# EAGLE design expCard (EAGLE 4.16)
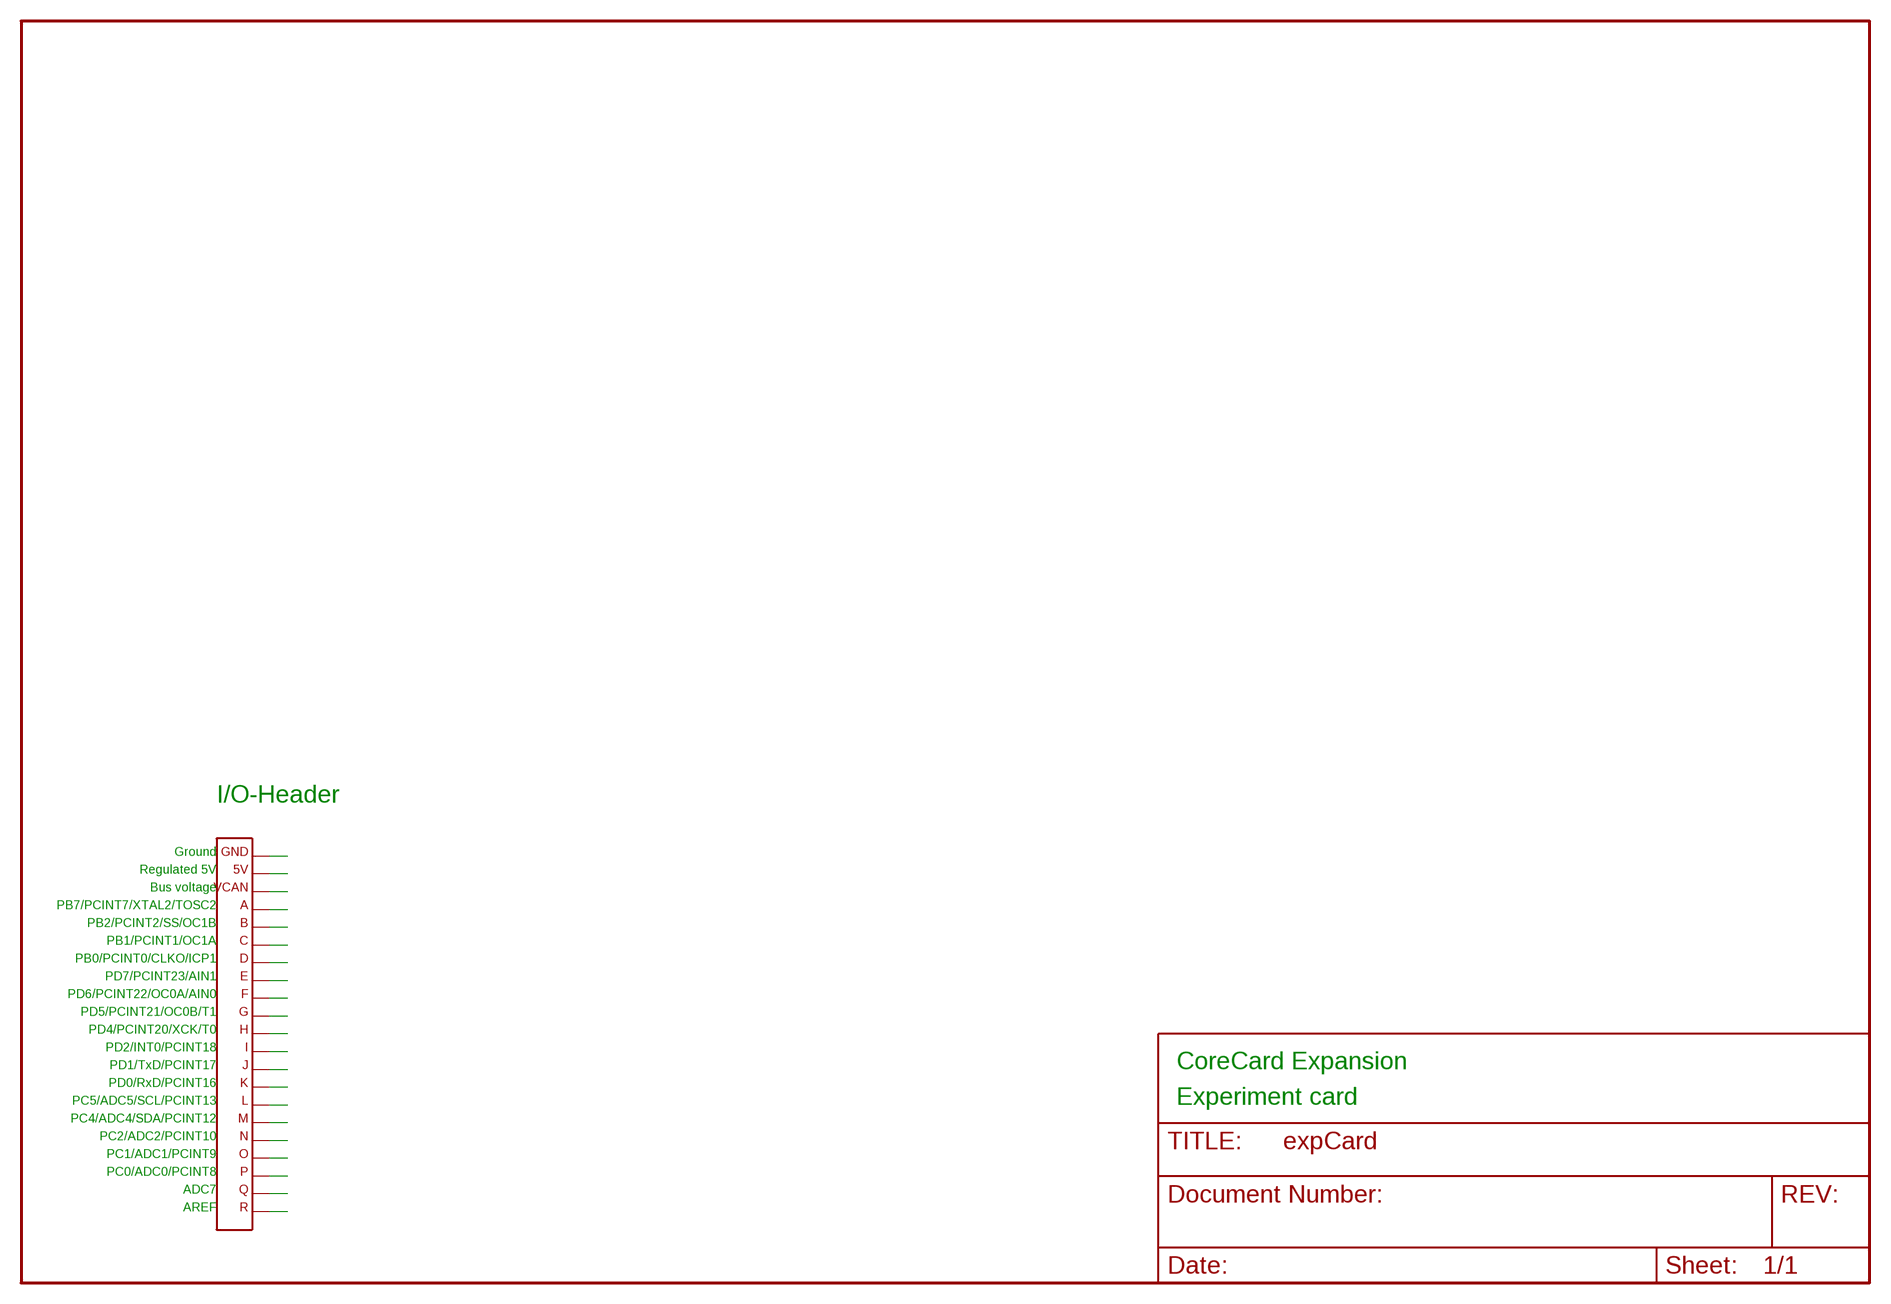
[diagram p0: schematic, sheet 1]

## Parts
X3  CORE_IOHEADEXP  [CORE_IOHEAD_NOSILC]

## Nets
EXP_A: X3.4
EXP_B: X3.5
EXP_C: X3.6
EXP_D: X3.7
EXP_E: X3.8
EXP_F: X3.9
EXP_G: X3.10
EXP_H: X3.11
EXP_I: X3.12
EXP_J: X3.13
EXP_K: X3.14
EXP_L: X3.15
EXP_M: X3.16
EXP_N: X3.17
EXP_O: X3.18
EXP_P: X3.19
EXP_Q: X3.20
EXP_R: X3.21
GND: X3.1
V_CAN: X3.3
VCC: X3.2

## Notes on the sheet
- I/O-Header
- Ground
- Regulated 5V
- Bus voltage
- PB7/PCINT7/XTAL2/TOSC2
- PB2/PCINT2/SS/OC1B
- PB1/PCINT1/OC1A
- PB0/PCINT0/CLKO/ICP1
- PD7/PCINT23/AIN1
- PD6/PCINT22/OC0A/AIN0
- PD5/PCINT21/OC0B/T1
- PD4/PCINT20/XCK/T0
- PD2/INT0/PCINT18
- PD1/TxD/PCINT17 | CoreCard Expansion
- PD0/RxD/PCINT16
- PC5/ADC5/SCL/PCINT13 | Experiment card
- PC4/ADC4/SDA/PCINT12
- PC2/ADC2/PCINT10
- PC1/ADC1/PCINT9
- PC0/ADC0/PCINT8
- ADC7
- AREF

## Library data of the parts
X3 = expboard:CORE_IOHEAD: CoreCard IO-header for expansion cards

## Board
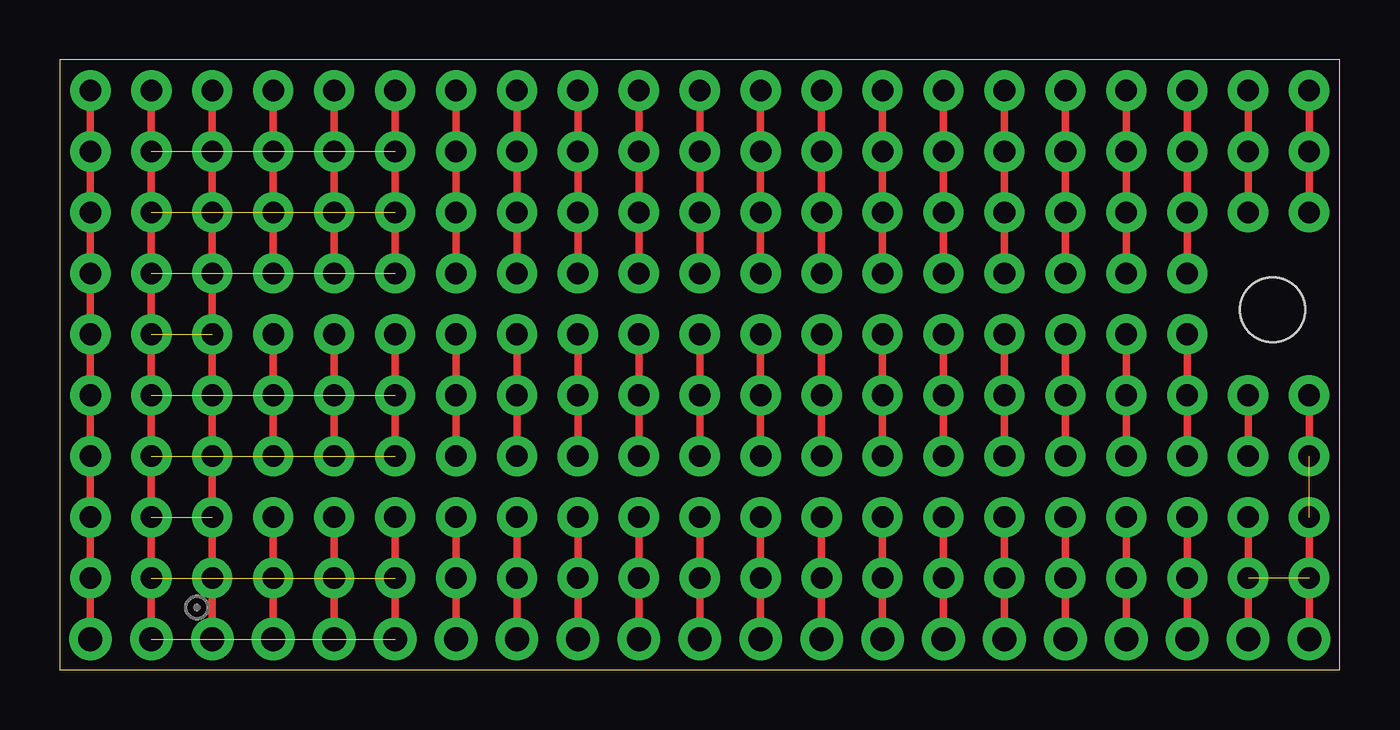
[diagram p1: board, top side]
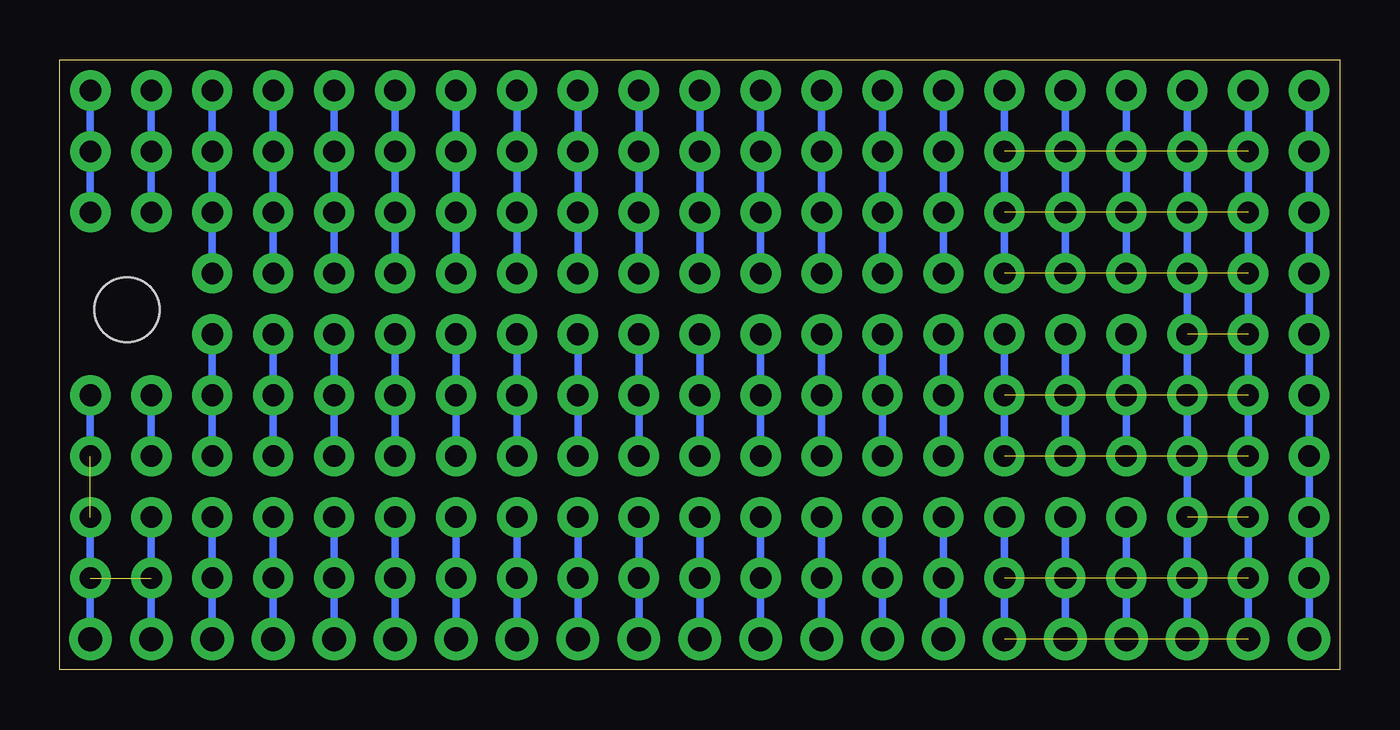
[diagram p2: board, bottom side, seen from below]

Size 53.34 x 25.4 mm. Coordinates in mm from the lower left corner, seen from the top.
Outline: 0,0 53.34,0 53.34,25.4 0,25.4 0,0
Copper layers (1*16): Top 0.035mm / dielectric 1.5mm / Bottom 0.035mm
Design rules "default": minimum track width 10mil, minimum drill 0.4mm, track to track 10mil, track to pad 10mil, pad to pad 10mil, via to via 10mil, smd to smd 8mil, copper to edge 10mil, drill to drill 8mil, minimum pad ring 10mil, minimum via ring 10mil, stop-mask expansion 4mil, vias tented up to drill 18mil, thermal gap 10mil
Holes 2.7 mm at 50.55,14.99

### Footprints (pad centres in the part's own frame; a part is rotated, then mirrored left to right if it is on the bottom)
CORE_IOHEAD_NOSILC = drill 1 pad 1.778 round: 1 25.4,0; 2 22.86,0; 3 20.32,0; 4 17.78,0; 5 15.24,0; 6 12.7,0; 7 10.16,0; 8 7.62,0; 9 5.08,0; 10 2.54,0; 11 0,0; 12 -2.54,0; 13 -5.08,0; 14 -7.62,0; 15 -10.16,0; 16 -12.7,0; 17 -15.24,0; 18 -17.78,0; 19 -20.32,0; 20 -22.86,0; 21 -25.4,0

### Placement (x,y rotation side)
X3  26.67,1.27 0 bottom

### Tracks (layer width: path | path; a pad name or v marks a point on that pad's centre or on a via)
GND  (via drill 0.9 pad 1.68)
  Top 0.305: X3.1 v1.27,3.81 X3.1
  Bottom 0.305: X3.1 v1.27,3.81
GND1  (via drill 0.9 pad 1.68)
  Top 0.305: v1.27,6.35 1.27,3.81 v1.27,6.35
  Bottom 0.305: 1.27,3.81 v1.27,6.35
GND2  (via drill 0.9 pad 1.68)
  Top 0.305: v1.27,8.89 1.27,6.35 v1.27,8.89
  Bottom 0.305: 1.27,6.35 v1.27,8.89
GND3  (via drill 0.9 pad 1.68)
  Top 0.305: v1.27,11.43 1.27,8.89 v1.27,11.43
  Bottom 0.305: 1.27,8.89 v1.27,11.43
GND4  (via drill 0.9 pad 1.68)
  Top 0.305: v1.27,13.97 1.27,11.43 v1.27,13.97
  Bottom 0.305: 1.27,11.43 v1.27,13.97
GND5  (via drill 0.9 pad 1.68)
  Top 0.305: v1.27,16.51 1.27,13.97 v1.27,16.51
  Bottom 0.305: 1.27,13.97 v1.27,16.51
GND6  (via drill 0.9 pad 1.68)
  Top 0.305: v1.27,19.05 1.27,16.51 v1.27,19.05
  Bottom 0.305: 1.27,16.51 v1.27,19.05
GND7  (via drill 0.9 pad 1.68)
  Top 0.305: v1.27,21.59 1.27,19.05 v1.27,21.59
  Bottom 0.305: 1.27,19.05 v1.27,21.59
GND8  (via drill 0.9 pad 1.68)
  Top 0.305: v1.27,24.13 1.27,21.59 v1.27,24.13
  Bottom 0.305: 1.27,21.59 v1.27,24.13
N$1  (via drill 0.9 pad 1.68)
  other vias: 3.81,3.81
N$2  (via drill 0.9 pad 1.68)
  other vias: 6.35,3.81
N$3  (via drill 0.9 pad 1.68)
  other vias: 8.89,3.81
N$4  (via drill 0.9 pad 1.68)
  other vias: 11.43,3.81
N$5  (via drill 0.9 pad 1.68)
  other vias: 13.97,3.81
N$6  (via drill 0.9 pad 1.68)
  other vias: 16.51,3.81
N$7  (via drill 0.9 pad 1.68)
  other vias: 19.05,3.81
N$8  (via drill 0.9 pad 1.68)
  other vias: 21.59,3.81
N$9  (via drill 0.9 pad 1.68)
  other vias: 24.13,3.81
N$10  (via drill 0.9 pad 1.68)
  other vias: 26.67,3.81
N$11  (via drill 0.9 pad 1.68)
  other vias: 29.21,3.81
N$12  (via drill 0.9 pad 1.68)
  other vias: 31.75,3.81
N$13  (via drill 0.9 pad 1.68)
  other vias: 34.29,3.81
N$14  (via drill 0.9 pad 1.68)
  other vias: 36.83,3.81
N$15  (via drill 0.9 pad 1.68)
  other vias: 39.37,3.81
N$16  (via drill 0.9 pad 1.68)
  other vias: 41.91,3.81
N$17  (via drill 0.9 pad 1.68)
  other vias: 44.45,3.81
N$18  (via drill 0.9 pad 1.68)
  other vias: 46.99,3.81
N$19  (via drill 0.9 pad 1.68)
  other vias: 49.53,3.81
N$20  (via drill 0.9 pad 1.68)  (1 unrouted)
  Top 0.305: v52.07,3.81 v52.07,6.35 | v52.07,8.89 v52.07,11.43
  Bottom 0.305: v52.07,6.35 v52.07,3.81 52.07,1.27 | v52.07,8.89 v52.07,11.43
N$21  (4 unrouted)
  Bottom 0.305: 3.81,1.27 3.81,3.81 | 6.35,1.27 6.35,3.81 | 8.89,1.27 8.89,3.81 | 11.43,1.27 11.43,3.81 | 13.97,1.27 13.97,3.81
N$22  (4 unrouted)
  Top 0.305: 3.81,1.27 3.81,3.81 | 6.35,1.27 6.35,3.81 | 8.89,1.27 8.89,3.81 | 11.43,1.27 11.43,3.81 | 13.97,1.27 13.97,3.81
N$23
  Bottom 0.305: 16.51,1.27 16.51,3.81
N$24
  Top 0.305: 16.51,1.27 16.51,3.81
N$25
  Bottom 0.305: 19.05,1.27 19.05,3.81
N$26
  Top 0.305: 19.05,1.27 19.05,3.81
N$27
  Bottom 0.305: 21.59,1.27 21.59,3.81
N$28
  Top 0.305: 21.59,1.27 21.59,3.81
N$29
  Bottom 0.305: 24.13,1.27 24.13,3.81
N$30
  Top 0.305: 24.13,1.27 24.13,3.81
N$31
  Bottom 0.305: 26.67,1.27 26.67,3.81
N$32
  Top 0.305: 26.67,1.27 26.67,3.81
N$33
  Bottom 0.305: 29.21,1.27 29.21,3.81
N$34
  Top 0.305: 29.21,1.27 29.21,3.81
N$35
  Bottom 0.305: 31.75,1.27 31.75,3.81
N$36
  Top 0.305: 31.75,1.27 31.75,3.81
N$37
  Bottom 0.305: 34.29,1.27 34.29,3.81
N$38
  Top 0.305: 34.29,1.27 34.29,3.81
N$39
  Bottom 0.305: 36.83,1.27 36.83,3.81
N$40
  Top 0.305: 36.83,1.27 36.83,3.81
N$41
  Bottom 0.305: 39.37,1.27 39.37,3.81
N$42
  Top 0.305: 39.37,1.27 39.37,3.81
N$43
  Bottom 0.305: 41.91,1.27 41.91,3.81
N$44
  Top 0.305: 41.91,1.27 41.91,3.81
N$45
  Bottom 0.305: 44.45,1.27 44.45,3.81
N$46
  Top 0.305: 44.45,1.27 44.45,3.81
N$47
  Bottom 0.305: 46.99,1.27 46.99,3.81
N$48
  Top 0.305: 46.99,1.27 46.99,3.81
N$49
  Bottom 0.305: 49.53,1.27 49.53,3.81
N$50
  Top 0.305: 49.53,1.27 49.53,3.81
N$51  (via drill 0.9 pad 1.68)
  other vias: 3.81,6.35
N$52  (via drill 0.9 pad 1.68)
  other vias: 6.35,6.35
N$53  (via drill 0.9 pad 1.68)
  other vias: 8.89,6.35
N$54  (via drill 0.9 pad 1.68)
  other vias: 11.43,6.35
N$55  (via drill 0.9 pad 1.68)
  other vias: 13.97,6.35
N$56  (via drill 0.9 pad 1.68)
  other vias: 16.51,6.35
N$57  (via drill 0.9 pad 1.68)
  other vias: 19.05,6.35
N$58  (via drill 0.9 pad 1.68)
  other vias: 21.59,6.35
N$59  (via drill 0.9 pad 1.68)
  other vias: 24.13,6.35
N$60  (via drill 0.9 pad 1.68)
  other vias: 26.67,6.35
N$61  (via drill 0.9 pad 1.68)
  other vias: 29.21,6.35
N$62  (via drill 0.9 pad 1.68)
  other vias: 31.75,6.35
N$63  (via drill 0.9 pad 1.68)
  other vias: 34.29,6.35
N$64  (via drill 0.9 pad 1.68)
  other vias: 36.83,6.35
N$65  (via drill 0.9 pad 1.68)
  other vias: 39.37,6.35
N$66  (via drill 0.9 pad 1.68)
  other vias: 41.91,6.35
N$67  (via drill 0.9 pad 1.68)
  other vias: 44.45,6.35
N$68  (via drill 0.9 pad 1.68)
  other vias: 46.99,6.35
N$69  (via drill 0.9 pad 1.68)
  other vias: 49.53,6.35
N$70  (via drill 0.9 pad 1.68)
  Top 0.305: v52.07,19.05 v52.07,21.59
  Bottom 0.305: v52.07,19.05 v52.07,21.59
N$71  (4 unrouted)
  Bottom 0.305: 3.81,3.81 3.81,6.35 | 6.35,3.81 6.35,6.35 | 8.89,3.81 8.89,6.35 | 11.43,3.81 11.43,6.35 | 13.97,3.81 13.97,6.35
N$72  (4 unrouted)
  Top 0.305: 3.81,3.81 3.81,6.35 | 6.35,3.81 6.35,6.35 | 8.89,3.81 8.89,6.35 | 11.43,3.81 11.43,6.35 | 13.97,3.81 13.97,6.35
N$73
  Bottom 0.305: 16.51,3.81 16.51,6.35
N$74
  Top 0.305: 16.51,3.81 16.51,6.35
N$75
  Bottom 0.305: 19.05,3.81 19.05,6.35
N$76
  Top 0.305: 19.05,3.81 19.05,6.35
N$77
  Bottom 0.305: 21.59,3.81 21.59,6.35
N$78
  Top 0.305: 21.59,3.81 21.59,6.35
N$79
  Bottom 0.305: 24.13,3.81 24.13,6.35
N$80
  Top 0.305: 24.13,3.81 24.13,6.35
N$81
  Bottom 0.305: 26.67,3.81 26.67,6.35
N$82
  Top 0.305: 26.67,3.81 26.67,6.35
N$83
  Bottom 0.305: 29.21,3.81 29.21,6.35
N$84
  Top 0.305: 29.21,3.81 29.21,6.35
N$85
  Bottom 0.305: 31.75,3.81 31.75,6.35
N$86
  Top 0.305: 31.75,3.81 31.75,6.35
N$87
  Bottom 0.305: 34.29,3.81 34.29,6.35
N$88
  Top 0.305: 34.29,3.81 34.29,6.35
N$89
  Bottom 0.305: 36.83,3.81 36.83,6.35
N$90
  Top 0.305: 36.83,3.81 36.83,6.35
N$91
  Bottom 0.305: 39.37,3.81 39.37,6.35
N$92
  Top 0.305: 39.37,3.81 39.37,6.35
N$93
  Bottom 0.305: 41.91,3.81 41.91,6.35
N$94
  Top 0.305: 41.91,3.81 41.91,6.35
N$95
  Bottom 0.305: 44.45,3.81 44.45,6.35
N$96
  Top 0.305: 44.45,3.81 44.45,6.35
N$97
  Bottom 0.305: 46.99,3.81 46.99,6.35
N$98
  Top 0.305: 46.99,3.81 46.99,6.35
N$99
  Bottom 0.305: 49.53,3.81 49.53,6.35
N$100  (1 unrouted)
  Top 0.305: 49.53,3.81 49.53,6.35 | 52.07,1.27 52.07,3.81
N$101  (via drill 0.9 pad 1.68)
  other vias: 3.81,8.89
N$102  (via drill 0.9 pad 1.68)
  other vias: 6.35,8.89
N$103  (via drill 0.9 pad 1.68)
  other vias: 8.89,8.89
N$104  (via drill 0.9 pad 1.68)
  other vias: 11.43,8.89
N$105  (via drill 0.9 pad 1.68)
  other vias: 13.97,8.89
N$106  (via drill 0.9 pad 1.68)
  other vias: 16.51,8.89
N$107  (via drill 0.9 pad 1.68)
  other vias: 19.05,8.89
N$108  (via drill 0.9 pad 1.68)
  other vias: 21.59,8.89
N$109  (via drill 0.9 pad 1.68)
  other vias: 24.13,8.89
N$110  (via drill 0.9 pad 1.68)
  other vias: 26.67,8.89
N$111  (via drill 0.9 pad 1.68)
  other vias: 29.21,8.89
N$112  (via drill 0.9 pad 1.68)
  other vias: 31.75,8.89
N$113  (via drill 0.9 pad 1.68)
  other vias: 34.29,8.89
N$114  (via drill 0.9 pad 1.68)
  other vias: 36.83,8.89
N$115  (via drill 0.9 pad 1.68)
  other vias: 39.37,8.89
N$116  (via drill 0.9 pad 1.68)
  other vias: 41.91,8.89
N$117  (via drill 0.9 pad 1.68)
  other vias: 44.45,8.89
N$118  (via drill 0.9 pad 1.68)
  other vias: 46.99,8.89
N$119  (via drill 0.9 pad 1.68)
  other vias: 49.53,8.89
N$120  (via drill 0.9 pad 1.68)
  other vias: 49.53,19.05
N$121  (1 unrouted)
  Bottom 0.305: 3.81,6.35 3.81,8.89 | 6.35,6.35 6.35,8.89
N$122  (1 unrouted)
  Top 0.305: 3.81,6.35 3.81,8.89 | 6.35,6.35 6.35,8.89
N$151  (via drill 0.9 pad 1.68)
  other vias: 3.81,11.43
N$152  (via drill 0.9 pad 1.68)
  other vias: 6.35,11.43
N$153  (via drill 0.9 pad 1.68)
  other vias: 8.89,11.43
N$154  (via drill 0.9 pad 1.68)
  other vias: 11.43,11.43
N$155  (via drill 0.9 pad 1.68)
  other vias: 13.97,11.43
N$156  (via drill 0.9 pad 1.68)
  other vias: 16.51,11.43
N$157  (via drill 0.9 pad 1.68)
  other vias: 19.05,11.43
N$158  (via drill 0.9 pad 1.68)
  other vias: 21.59,11.43
N$159  (via drill 0.9 pad 1.68)
  other vias: 24.13,11.43
N$160  (via drill 0.9 pad 1.68)
  other vias: 26.67,11.43
N$161  (via drill 0.9 pad 1.68)
  other vias: 29.21,11.43
N$162  (via drill 0.9 pad 1.68)
  other vias: 31.75,11.43
N$163  (via drill 0.9 pad 1.68)
  other vias: 34.29,11.43
N$164  (via drill 0.9 pad 1.68)
  other vias: 36.83,11.43
N$165  (via drill 0.9 pad 1.68)
  other vias: 39.37,11.43
N$166  (via drill 0.9 pad 1.68)
  other vias: 41.91,11.43
N$167  (via drill 0.9 pad 1.68)
  other vias: 44.45,11.43
N$168  (via drill 0.9 pad 1.68)
  other vias: 46.99,11.43
N$169  (via drill 0.9 pad 1.68)
  other vias: 49.53,11.43
N$170  (4 unrouted)
  Bottom 0.305: 3.81,8.89 3.81,11.43 | 6.35,8.89 6.35,11.43 | 8.89,8.89 8.89,11.43 | 11.43,8.89 11.43,11.43 | 13.97,8.89 13.97,11.43
N$171  (4 unrouted)
  Top 0.305: 3.81,8.89 3.81,11.43 | 6.35,8.89 6.35,11.43 | 8.89,8.89 8.89,11.43 | 11.43,8.89 11.43,11.43 | 13.97,8.89 13.97,11.43
N$172
  Bottom 0.305: 16.51,8.89 16.51,11.43
N$173
  Top 0.305: 16.51,8.89 16.51,11.43
N$174
  Bottom 0.305: 19.05,8.89 19.05,11.43
N$175
  Top 0.305: 19.05,8.89 19.05,11.43
N$176
  Bottom 0.305: 21.59,8.89 21.59,11.43
N$177
  Top 0.305: 21.59,8.89 21.59,11.43
N$178
  Bottom 0.305: 24.13,8.89 24.13,11.43
N$179
  Top 0.305: 24.13,8.89 24.13,11.43
N$180
  Bottom 0.305: 26.67,8.89 26.67,11.43
N$181
  Top 0.305: 26.67,8.89 26.67,11.43
N$182
  Bottom 0.305: 29.21,8.89 29.21,11.43
N$183
  Top 0.305: 29.21,8.89 29.21,11.43
N$184
  Bottom 0.305: 31.75,8.89 31.75,11.43
N$185
  Top 0.305: 31.75,8.89 31.75,11.43
N$186
  Bottom 0.305: 34.29,8.89 34.29,11.43
N$187
  Top 0.305: 34.29,8.89 34.29,11.43
N$188
  Bottom 0.305: 36.83,8.89 36.83,11.43
N$189
  Top 0.305: 36.83,8.89 36.83,11.43
N$190
  Bottom 0.305: 39.37,8.89 39.37,11.43
N$191
  Top 0.305: 39.37,8.89 39.37,11.43
N$192
  Bottom 0.305: 41.91,8.89 41.91,11.43
N$193
  Top 0.305: 41.91,8.89 41.91,11.43
N$194
  Bottom 0.305: 44.45,8.89 44.45,11.43
N$195
  Top 0.305: 44.45,8.89 44.45,11.43
N$196
  Bottom 0.305: 46.99,8.89 46.99,11.43
N$197
  Top 0.305: 46.99,8.89 46.99,11.43
N$198
  Bottom 0.305: 49.53,8.89 49.53,11.43
N$199
  Top 0.305: 49.53,8.89 49.53,11.43
N$200  (via drill 0.9 pad 1.68)
  other vias: 3.81,13.97
N$201  (via drill 0.9 pad 1.68)
  other vias: 6.35,13.97
N$202  (via drill 0.9 pad 1.68)
  other vias: 8.89,13.97
N$203  (via drill 0.9 pad 1.68)
  other vias: 11.43,13.97
N$204  (via drill 0.9 pad 1.68)
  other vias: 13.97,13.97
N$205  (via drill 0.9 pad 1.68)
  other vias: 16.51,13.97
N$206  (via drill 0.9 pad 1.68)
  other vias: 19.05,13.97
N$207  (via drill 0.9 pad 1.68)
  other vias: 21.59,13.97
N$208  (via drill 0.9 pad 1.68)
  other vias: 24.13,13.97
N$209  (via drill 0.9 pad 1.68)
  other vias: 26.67,13.97
N$210  (via drill 0.9 pad 1.68)
  other vias: 29.21,13.97
N$211  (via drill 0.9 pad 1.68)
  other vias: 31.75,13.97
N$212  (via drill 0.9 pad 1.68)
  other vias: 34.29,13.97
N$213  (via drill 0.9 pad 1.68)
  other vias: 36.83,13.97
N$214  (via drill 0.9 pad 1.68)
  other vias: 39.37,13.97
N$215  (via drill 0.9 pad 1.68)
  other vias: 41.91,13.97
N$216  (via drill 0.9 pad 1.68)
  other vias: 44.45,13.97
N$217  (via drill 0.9 pad 1.68)
  other vias: 46.99,13.97
N$218  (4 unrouted)
  Bottom 0.305: 3.81,11.43 3.81,13.97 | 6.35,11.43 6.35,13.97 | 8.89,11.43 8.89,13.97 | 11.43,11.43 11.43,13.97 | 13.97,11.43 13.97,13.97
N$219  (4 unrouted)
  Top 0.305: 3.81,11.43 3.81,13.97 | 6.35,11.43 6.35,13.97 | 8.89,11.43 8.89,13.97 | 11.43,11.43 11.43,13.97 | 13.97,11.43 13.97,13.97
N$220
  Bottom 0.305: 16.51,11.43 16.51,13.97
N$221
  Top 0.305: 16.51,11.43 16.51,13.97
N$222
  Bottom 0.305: 19.05,11.43 19.05,13.97
N$223
  Top 0.305: 19.05,11.43 19.05,13.97
N$224
  Bottom 0.305: 21.59,11.43 21.59,13.97
N$225
  Top 0.305: 21.59,11.43 21.59,13.97
N$226
  Bottom 0.305: 24.13,11.43 24.13,13.97
N$227
  Top 0.305: 24.13,11.43 24.13,13.97
N$228
  Bottom 0.305: 26.67,11.43 26.67,13.97
N$229
  Top 0.305: 26.67,11.43 26.67,13.97
N$230
  Bottom 0.305: 29.21,11.43 29.21,13.97
N$231
  Top 0.305: 29.21,11.43 29.21,13.97
N$232
  Bottom 0.305: 31.75,11.43 31.75,13.97
N$233
  Top 0.305: 31.75,11.43 31.75,13.97
N$234
  Bottom 0.305: 34.29,11.43 34.29,13.97
N$235
  Top 0.305: 34.29,11.43 34.29,13.97
N$236
  Bottom 0.305: 36.83,11.43 36.83,13.97
N$237
  Top 0.305: 36.83,11.43 36.83,13.97
N$238
  Bottom 0.305: 39.37,11.43 39.37,13.97
N$239
  Top 0.305: 39.37,11.43 39.37,13.97
N$240
  Bottom 0.305: 41.91,11.43 41.91,13.97
N$241
  Top 0.305: 41.91,11.43 41.91,13.97
N$242
  Bottom 0.305: 44.45,11.43 44.45,13.97
N$243
  Top 0.305: 44.45,11.43 44.45,13.97
N$244
  Bottom 0.305: 46.99,11.43 46.99,13.97
N$245
  Top 0.305: 46.99,11.43 46.99,13.97
N$246  (via drill 0.9 pad 1.68)
  other vias: 3.81,16.51
N$247  (via drill 0.9 pad 1.68)
  other vias: 6.35,16.51
N$248  (via drill 0.9 pad 1.68)
  other vias: 8.89,16.51
N$249  (via drill 0.9 pad 1.68)
  other vias: 11.43,16.51
N$250  (via drill 0.9 pad 1.68)
  other vias: 13.97,16.51
N$251  (via drill 0.9 pad 1.68)
  other vias: 16.51,16.51
N$252  (via drill 0.9 pad 1.68)
  other vias: 19.05,16.51
N$253  (via drill 0.9 pad 1.68)
  other vias: 21.59,16.51
N$254  (via drill 0.9 pad 1.68)
  other vias: 24.13,16.51
N$255  (via drill 0.9 pad 1.68)
  other vias: 26.67,16.51
N$256  (via drill 0.9 pad 1.68)
  other vias: 29.21,16.51
N$257  (via drill 0.9 pad 1.68)
  other vias: 31.75,16.51
N$258  (via drill 0.9 pad 1.68)
  other vias: 34.29,16.51
N$259  (via drill 0.9 pad 1.68)
  other vias: 36.83,16.51
N$260  (via drill 0.9 pad 1.68)
  other vias: 39.37,16.51
N$261  (via drill 0.9 pad 1.68)
  other vias: 41.91,16.51
N$262  (via drill 0.9 pad 1.68)
  other vias: 44.45,16.51
N$263  (via drill 0.9 pad 1.68)
  other vias: 46.99,16.51
N$264  (1 unrouted)
  Bottom 0.305: 3.81,13.97 3.81,16.51 | 6.35,13.97 6.35,16.51
N$265  (1 unrouted)
  Top 0.305: 3.81,13.97 3.81,16.51 | 6.35,13.97 6.35,16.51
N$292  (via drill 0.9 pad 1.68)
  other vias: 3.81,19.05
N$293  (via drill 0.9 pad 1.68)
  other vias: 6.35,19.05
N$294  (via drill 0.9 pad 1.68)
  other vias: 8.89,19.05
N$295  (via drill 0.9 pad 1.68)
  other vias: 11.43,19.05
N$296  (via drill 0.9 pad 1.68)
  other vias: 13.97,19.05
N$297  (via drill 0.9 pad 1.68)
  other vias: 16.51,19.05
N$298  (via drill 0.9 pad 1.68)
  other vias: 19.05,19.05
N$299  (via drill 0.9 pad 1.68)
  other vias: 21.59,19.05
N$300  (via drill 0.9 pad 1.68)
  other vias: 24.13,19.05
N$301  (via drill 0.9 pad 1.68)
  other vias: 26.67,19.05
N$302  (via drill 0.9 pad 1.68)
  other vias: 29.21,19.05
N$303  (via drill 0.9 pad 1.68)
  other vias: 31.75,19.05
N$304  (via drill 0.9 pad 1.68)
  other vias: 34.29,19.05
N$305  (via drill 0.9 pad 1.68)
  other vias: 36.83,19.05
N$306  (via drill 0.9 pad 1.68)
  other vias: 39.37,19.05
N$307  (via drill 0.9 pad 1.68)
  other vias: 41.91,19.05
N$308  (via drill 0.9 pad 1.68)
  other vias: 44.45,19.05
N$309  (via drill 0.9 pad 1.68)
  other vias: 46.99,19.05
N$310  (4 unrouted)
  Bottom 0.305: 3.81,16.51 3.81,19.05 | 6.35,16.51 6.35,19.05 | 8.89,16.51 8.89,19.05 | 11.43,16.51 11.43,19.05 | 13.97,16.51 13.97,19.05
N$311  (4 unrouted)
  Top 0.305: 3.81,16.51 3.81,19.05 | 6.35,16.51 6.35,19.05 | 8.89,16.51 8.89,19.05 | 11.43,16.51 11.43,19.05 | 13.97,16.51 13.97,19.05
N$312
  Bottom 0.305: 16.51,16.51 16.51,19.05
N$313
  Top 0.305: 16.51,16.51 16.51,19.05
N$314
  Bottom 0.305: 19.05,16.51 19.05,19.05
N$315
  Top 0.305: 19.05,16.51 19.05,19.05
N$316
  Bottom 0.305: 21.59,16.51 21.59,19.05
N$317
  Top 0.305: 21.59,16.51 21.59,19.05
N$318
  Bottom 0.305: 24.13,16.51 24.13,19.05
N$319
  Top 0.305: 24.13,16.51 24.13,19.05
N$320
  Bottom 0.305: 26.67,16.51 26.67,19.05
N$321
  Top 0.305: 26.67,16.51 26.67,19.05
N$322
  Bottom 0.305: 29.21,16.51 29.21,19.05
N$323
  Top 0.305: 29.21,16.51 29.21,19.05
N$324
  Bottom 0.305: 31.75,16.51 31.75,19.05
N$325
  Top 0.305: 31.75,16.51 31.75,19.05
N$326
  Bottom 0.305: 34.29,16.51 34.29,19.05
N$327
  Top 0.305: 34.29,16.51 34.29,19.05
N$328
  Bottom 0.305: 36.83,16.51 36.83,19.05
N$329
  Top 0.305: 36.83,16.51 36.83,19.05
N$330
  Bottom 0.305: 39.37,16.51 39.37,19.05
N$331
  Top 0.305: 39.37,16.51 39.37,19.05
N$332
  Bottom 0.305: 41.91,16.51 41.91,19.05
N$333
  Top 0.305: 41.91,16.51 41.91,19.05
N$334
  Bottom 0.305: 44.45,16.51 44.45,19.05
N$335
  Top 0.305: 44.45,16.51 44.45,19.05
N$336
  Bottom 0.305: 46.99,16.51 46.99,19.05
N$337
  Top 0.305: 46.99,16.51 46.99,19.05
N$338  (via drill 0.9 pad 1.68)
  other vias: 3.81,21.59
N$339  (via drill 0.9 pad 1.68)
  other vias: 6.35,21.59
N$340  (via drill 0.9 pad 1.68)
  other vias: 8.89,21.59
N$341  (via drill 0.9 pad 1.68)
  other vias: 11.43,21.59
N$342  (via drill 0.9 pad 1.68)
  other vias: 13.97,21.59
N$343  (via drill 0.9 pad 1.68)
  other vias: 16.51,21.59
N$344  (via drill 0.9 pad 1.68)
  other vias: 19.05,21.59
N$345  (via drill 0.9 pad 1.68)
  other vias: 21.59,21.59
N$346  (via drill 0.9 pad 1.68)
  other vias: 24.13,21.59
N$347  (via drill 0.9 pad 1.68)
  other vias: 26.67,21.59
N$348  (via drill 0.9 pad 1.68)
  other vias: 29.21,21.59
N$349  (via drill 0.9 pad 1.68)
  other vias: 31.75,21.59
N$350  (via drill 0.9 pad 1.68)
  other vias: 34.29,21.59
N$351  (via drill 0.9 pad 1.68)
  other vias: 36.83,21.59
N$352  (via drill 0.9 pad 1.68)
  other vias: 39.37,21.59
N$353  (via drill 0.9 pad 1.68)
  other vias: 41.91,21.59
N$354  (via drill 0.9 pad 1.68)
  other vias: 44.45,21.59
N$355  (via drill 0.9 pad 1.68)
  other vias: 46.99,21.59
N$356  (4 unrouted)
  Bottom 0.305: 3.81,19.05 3.81,21.59 | 6.35,19.05 6.35,21.59 | 8.89,19.05 8.89,21.59 | 11.43,19.05 11.43,21.59 | 13.97,19.05 13.97,21.59
N$357  (4 unrouted)
  Top 0.305: 3.81,19.05 3.81,21.59 | 6.35,19.05 6.35,21.59 | 8.89,19.05 8.89,21.59 | 11.43,19.05 11.43,21.59 | 13.97,19.05 13.97,21.59
N$358
  Bottom 0.305: 16.51,19.05 16.51,21.59
N$359
  Top 0.305: 16.51,19.05 16.51,21.59
N$360
  Bottom 0.305: 19.05,19.05 19.05,21.59
N$361
  Top 0.305: 19.05,19.05 19.05,21.59
N$362
  Bottom 0.305: 21.59,19.05 21.59,21.59
N$363
  Top 0.305: 21.59,19.05 21.59,21.59
N$364
  Bottom 0.305: 24.13,19.05 24.13,21.59
N$365
  Top 0.305: 24.13,19.05 24.13,21.59
N$366
  Bottom 0.305: 26.67,19.05 26.67,21.59
N$367
  Top 0.305: 26.67,19.05 26.67,21.59
N$368
  Bottom 0.305: 29.21,19.05 29.21,21.59
N$369
  Top 0.305: 29.21,19.05 29.21,21.59
N$370
  Bottom 0.305: 31.75,19.05 31.75,21.59
N$371
  Top 0.305: 31.75,19.05 31.75,21.59
N$372
  Bottom 0.305: 34.29,19.05 34.29,21.59
N$373
  Top 0.305: 34.29,19.05 34.29,21.59
N$374
  Bottom 0.305: 36.83,19.05 36.83,21.59
N$375
  Top 0.305: 36.83,19.05 36.83,21.59
N$376
  Bottom 0.305: 39.37,19.05 39.37,21.59
N$377
  Top 0.305: 39.37,19.05 39.37,21.59
N$378
  Bottom 0.305: 41.91,19.05 41.91,21.59
N$379
  Top 0.305: 41.91,19.05 41.91,21.59
N$380
  Bottom 0.305: 44.45,19.05 44.45,21.59
N$381
  Top 0.305: 44.45,19.05 44.45,21.59
N$382
  Bottom 0.305: 46.99,19.05 46.99,21.59
N$383
  Top 0.305: 46.99,19.05 46.99,21.59
N$384  (via drill 0.9 pad 1.68)
  other vias: 49.53,21.59
N$385
  Bottom 0.305: 49.53,19.05 49.53,21.59
N$386
  Top 0.305: 49.53,19.05 49.53,21.59
N$387  (via drill 0.9 pad 1.68)
  other vias: 3.81,24.13
N$388  (via drill 0.9 pad 1.68)
  other vias: 6.35,24.13
N$389  (via drill 0.9 pad 1.68)
  other vias: 8.89,24.13
N$390  (via drill 0.9 pad 1.68)
  other vias: 11.43,24.13
N$391  (via drill 0.9 pad 1.68)
  other vias: 13.97,24.13
N$392  (via drill 0.9 pad 1.68)
  other vias: 16.51,24.13
N$393  (via drill 0.9 pad 1.68)
  other vias: 19.05,24.13
N$394  (via drill 0.9 pad 1.68)
  other vias: 21.59,24.13
N$395  (via drill 0.9 pad 1.68)
  other vias: 24.13,24.13
N$396  (via drill 0.9 pad 1.68)
  other vias: 26.67,24.13
N$397  (via drill 0.9 pad 1.68)
  other vias: 29.21,24.13
N$398  (via drill 0.9 pad 1.68)
  other vias: 31.75,24.13
N$399  (via drill 0.9 pad 1.68)
  other vias: 34.29,24.13
N$400  (via drill 0.9 pad 1.68)
  other vias: 36.83,24.13
N$401  (via drill 0.9 pad 1.68)
  other vias: 39.37,24.13
N$402  (via drill 0.9 pad 1.68)
  other vias: 41.91,24.13
N$403  (via drill 0.9 pad 1.68)
  other vias: 44.45,24.13
N$404  (via drill 0.9 pad 1.68)
  other vias: 46.99,24.13
N$405  (4 unrouted)
  Bottom 0.305: 3.81,21.59 3.81,24.13 | 6.35,21.59 6.35,24.13 | 8.89,21.59 8.89,24.13 | 11.43,21.59 11.43,24.13 | 13.97,21.59 13.97,24.13
N$406  (4 unrouted)
  Top 0.305: 3.81,21.59 3.81,24.13 | 6.35,21.59 6.35,24.13 | 8.89,21.59 8.89,24.13 | 11.43,21.59 11.43,24.13 | 13.97,21.59 13.97,24.13
N$407
  Bottom 0.305: 16.51,21.59 16.51,24.13
N$408
  Top 0.305: 16.51,21.59 16.51,24.13
N$409
  Bottom 0.305: 19.05,21.59 19.05,24.13
N$410
  Top 0.305: 19.05,21.59 19.05,24.13
N$411
  Bottom 0.305: 21.59,21.59 21.59,24.13
N$412
  Top 0.305: 21.59,21.59 21.59,24.13
N$413
  Bottom 0.305: 24.13,21.59 24.13,24.13
N$414
  Top 0.305: 24.13,21.59 24.13,24.13
N$415
  Bottom 0.305: 26.67,21.59 26.67,24.13
N$416
  Top 0.305: 26.67,21.59 26.67,24.13
N$417
  Bottom 0.305: 29.21,21.59 29.21,24.13
N$418
  Top 0.305: 29.21,21.59 29.21,24.13
N$419
  Bottom 0.305: 31.75,21.59 31.75,24.13
N$420
  Top 0.305: 31.75,21.59 31.75,24.13
N$421
  Bottom 0.305: 34.29,21.59 34.29,24.13
N$422
  Top 0.305: 34.29,21.59 34.29,24.13
N$423
  Bottom 0.305: 36.83,21.59 36.83,24.13
N$424
  Top 0.305: 36.83,21.59 36.83,24.13
N$425
  Bottom 0.305: 39.37,21.59 39.37,24.13
N$426
  Top 0.305: 39.37,21.59 39.37,24.13
N$427
  Bottom 0.305: 41.91,21.59 41.91,24.13
N$428
  Top 0.305: 41.91,21.59 41.91,24.13
N$429
  Bottom 0.305: 44.45,21.59 44.45,24.13
N$430
  Top 0.305: 44.45,21.59 44.45,24.13
N$431
  Bottom 0.305: 46.99,21.59 46.99,24.13
N$432
  Top 0.305: 46.99,21.59 46.99,24.13
N$433  (via drill 0.9 pad 1.68)
  Top 0.305: v52.07,24.13 52.07,21.59
  Bottom 0.305: 52.07,21.59 v52.07,24.13
N$434  (via drill 0.9 pad 1.68)
  other vias: 49.53,24.13
N$435
  Bottom 0.305: 49.53,21.59 49.53,24.13
N$436
  Top 0.305: 49.53,21.59 49.53,24.13

### Text on the board
Document: Top is component side | Expansion will be mounted bottom to bottom with CoreCard | Change vertical dimension to fit | Remove I/O-header silcscreen if neccesary | Remove mounting holes if neccesary
tDocu: - | + | A | B | C | D | E | F | G | H | I | J | K | L | M | N | O | P | Q | R